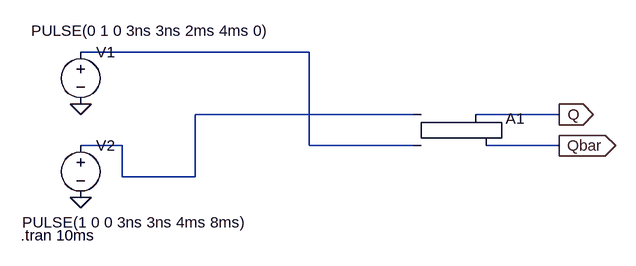
[diagram p0: schematic latch.asc]
latch.asc, the LTspice schematic file:
Version 4
SHEET 1 880 680
WIRE 176 64 -176 64
WIRE 336 160 0 160
WIRE 560 160 432 160
WIRE -112 208 -176 208
WIRE 176 208 176 64
WIRE 336 208 176 208
WIRE 560 208 448 208
WIRE -112 256 -112 208
WIRE 0 256 0 160
WIRE 0 256 -112 256
FLAG -176 288 0
FLAG -176 144 0
FLAG 560 160 Q
IOPIN 560 160 Out
FLAG 560 208 Qbar
IOPIN 560 208 Out
SYMBOL voltage -176 48 R0
WINDOW 3 -76 -17 Left 2
WINDOW 123 0 0 Left 0
WINDOW 39 0 0 Left 0
SYMATTR InstName V1
SYMATTR Value PULSE(0 1 0 3ns 3ns 2ms 4ms 0)
SYMBOL voltage -176 192 R0
WINDOW 3 -90 134 Left 2
WINDOW 123 0 0 Left 0
WINDOW 39 0 0 Left 0
SYMATTR InstName V2
SYMATTR Value PULSE(1 0 0 3ns 3ns 4ms 8ms)
SYMBOL Digital\\srflop 384 112 R0
SYMATTR InstName A1
TEXT -268 346 Left 2 !.tran 10ms

The netlist it stands for:
* latch.asc
V1 N001 0 PULSE(0 1 0 3ns 3ns 2ms 4ms 0)
V2 N002 0 PULSE(1 0 0 3ns 3ns 4ms 8ms)
A1 N002 N001 0 0 0 Qbar Q 0 SRFLOP
.tran 10ms
.backanno
.end